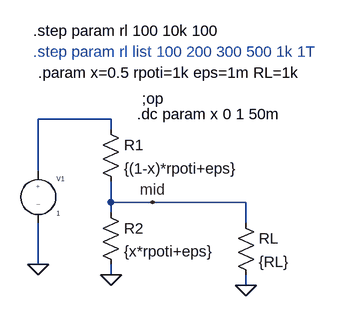
[diagram p0: schematic Draft2.asc]
Draft2.asc, the LTspice schematic file:
Version 4
SHEET 1 880 680
WIRE 112 64 0 64
WIRE 112 80 112 64
WIRE 0 144 0 64
WIRE 112 192 112 160
WIRE 176 192 112 192
WIRE 320 192 176 192
WIRE 112 208 112 192
WIRE 320 224 320 192
WIRE 0 288 0 224
WIRE 112 304 112 288
WIRE 320 320 320 304
FLAG 0 288 0
FLAG 112 304 0
FLAG 176 192 mid
FLAG 320 320 0
SYMBOL res 96 64 R0
SYMATTR InstName R1
SYMATTR Value {(1-x)*rpoti+eps}
SYMBOL res 96 192 R0
SYMATTR InstName R2
SYMATTR Value {x*rpoti+eps}
SYMBOL source-V 0 128 R0
SYMATTR InstName V1
SYMATTR Value 1
SYMBOL res 304 208 R0
SYMATTR InstName RL
SYMATTR Value {RL}
TEXT 0 -8 Left 2 !.param x=0.5 rpoti=1k eps=1m RL=1k
TEXT 160 32 Left 2 !;op
TEXT 152 56 Left 2 !.dc param x 0 1 50m
TEXT -8 -40 Left 2 ;.step param rl list 100 200 300 500 1k 1T
TEXT -8 -72 Left 2 !.step param rl 100 10k 100

The netlist it stands for:
* Draft2.asc
R1 N001 mid {(1-x)*rpoti+eps}
R2 mid 0 {x*rpoti+eps}
V1 N001 0 1
RL mid 0 {RL}
.param x=0.5 rpoti=1k eps=1m RL=1k
;op
.dc param x 0 1 50m
* .step param rl list 100 200 300 500 1k 1T
.step param rl 100 10k 100
.backanno
.end